# Altium schematic sheet Main.SchDoc
size A; SheetNumber: 1; SheetTotal: 8
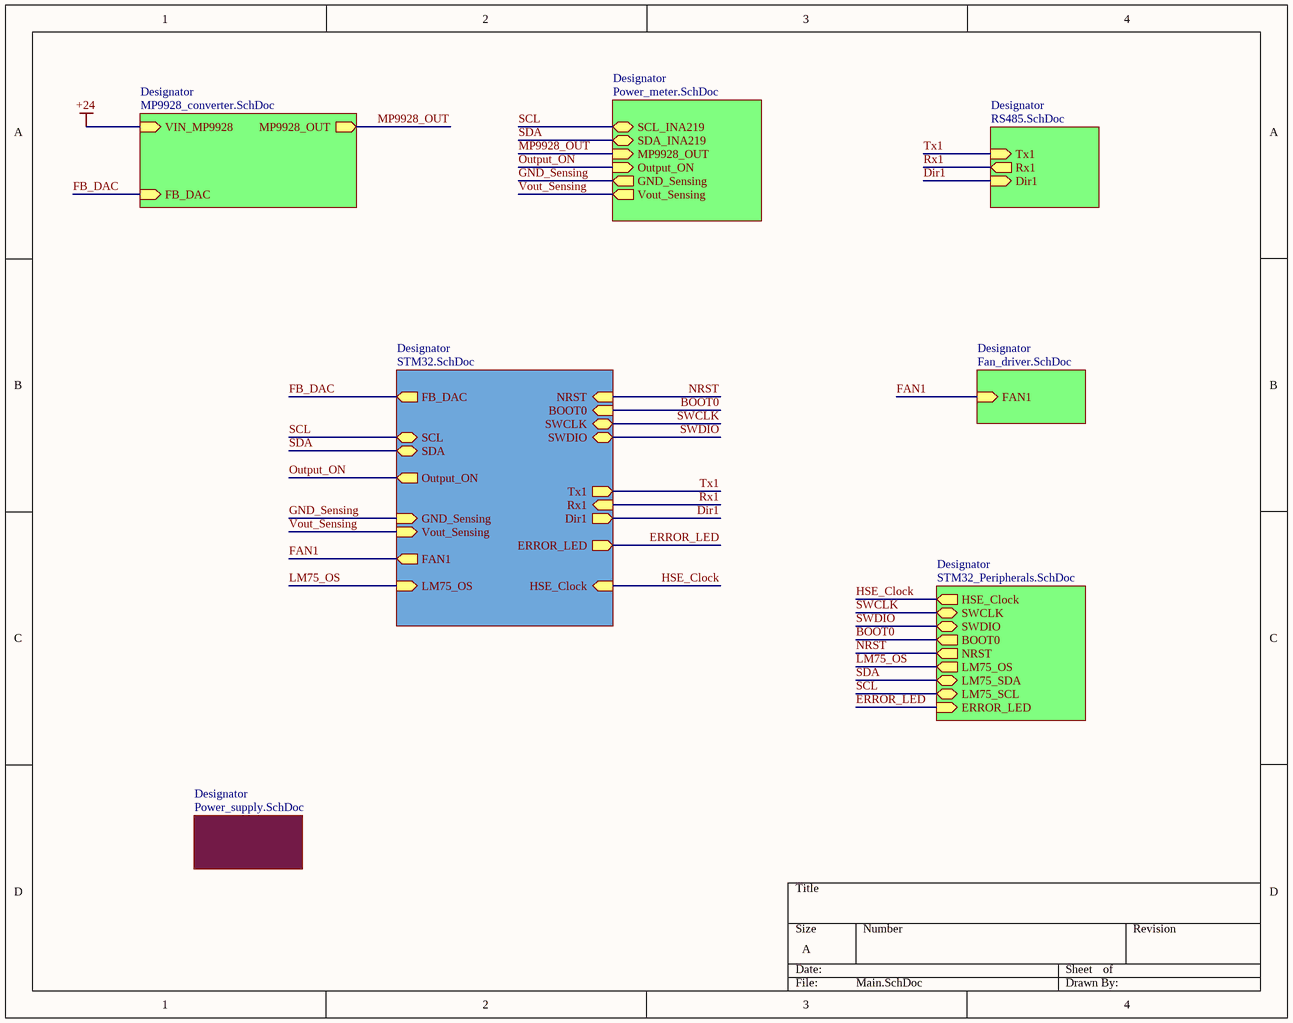
[diagram p0: Main.SchDoc]

## Sub-sheets
Designator = RS485.SchDoc: Tx1 (in), Rx1 (out), Dir1 (in)
Designator = Power_supply.SchDoc: no entries
Designator = Fan_driver.SchDoc: FAN1 (in)
Designator = STM32_Peripherals.SchDoc: HSE_Clock (out), SWCLK (bidir), SWDIO (bidir), BOOT0 (out), NRST (out), LM75_OS (out), LM75_SDA (bidir), LM75_SCL (bidir), ERROR_LED (in)
Designator = Power_meter.SchDoc: SCL_INA219 (bidir), SDA_INA219 (bidir), MP9928_OUT (in), Output_ON (in), GND_Sensing (out), Vout_Sensing (out)
Designator = MP9928_converter.SchDoc: FB_DAC (in), MP9928_OUT (out), VIN_MP9928 (in)
Designator = STM32.SchDoc: NRST (in), BOOT0 (in), SWCLK (bidir), SWDIO (bidir), FB_DAC (out), SCL (bidir), SDA (bidir), Output_ON (out), GND_Sensing (in), Vout_Sensing (in), FAN1 (out), LM75_OS (in), HSE_Clock (in), ERROR_LED (out), Tx1 (out), Rx1 (in), Dir1 (out)

## Nets
+24: sheet Designator/VIN_MP9928
BOOT0: sheet Designator/BOOT0, sheet Designator/BOOT0
Dir1: sheet Designator/Dir1, sheet Designator/Dir1
ERROR_LED: sheet Designator/ERROR_LED, sheet Designator/ERROR_LED
FAN1: sheet Designator/FAN1, sheet Designator/FAN1
FB_DAC: sheet Designator/FB_DAC, sheet Designator/FB_DAC
GND_Sensing: sheet Designator/GND_Sensing, sheet Designator/GND_Sensing
HSE_Clock: sheet Designator/HSE_Clock, sheet Designator/HSE_Clock
LM75_OS: sheet Designator/LM75_OS, sheet Designator/LM75_OS
MP9928_OUT: sheet Designator/MP9928_OUT, sheet Designator/MP9928_OUT
NRST: sheet Designator/NRST, sheet Designator/NRST
Output_ON: sheet Designator/Output_ON, sheet Designator/Output_ON
Rx1: sheet Designator/Rx1, sheet Designator/Rx1
SCL: sheet Designator/LM75_SCL, sheet Designator/SCL_INA219, sheet Designator/SCL
SDA: sheet Designator/LM75_SDA, sheet Designator/SDA_INA219, sheet Designator/SDA
SWCLK: sheet Designator/SWCLK, sheet Designator/SWCLK
SWDIO: sheet Designator/SWDIO, sheet Designator/SWDIO
Tx1: sheet Designator/Tx1, sheet Designator/Tx1
Vout_Sensing: sheet Designator/Vout_Sensing, sheet Designator/Vout_Sensing